# Altium schematic sheet 11 USB_2.SchDoc
size 420 x 297 mm; Address1: Address1; Address2: Address2; Address3: Address3; Address4: Address4; DocumentNumber: АБВГ.123456.001 Э3; SheetNumber: 11; SheetTotal: 23; Scale: 1:1; DocumentType: Схема электрическая принципиальная; FirstReferrence: АБВГ.123456.001
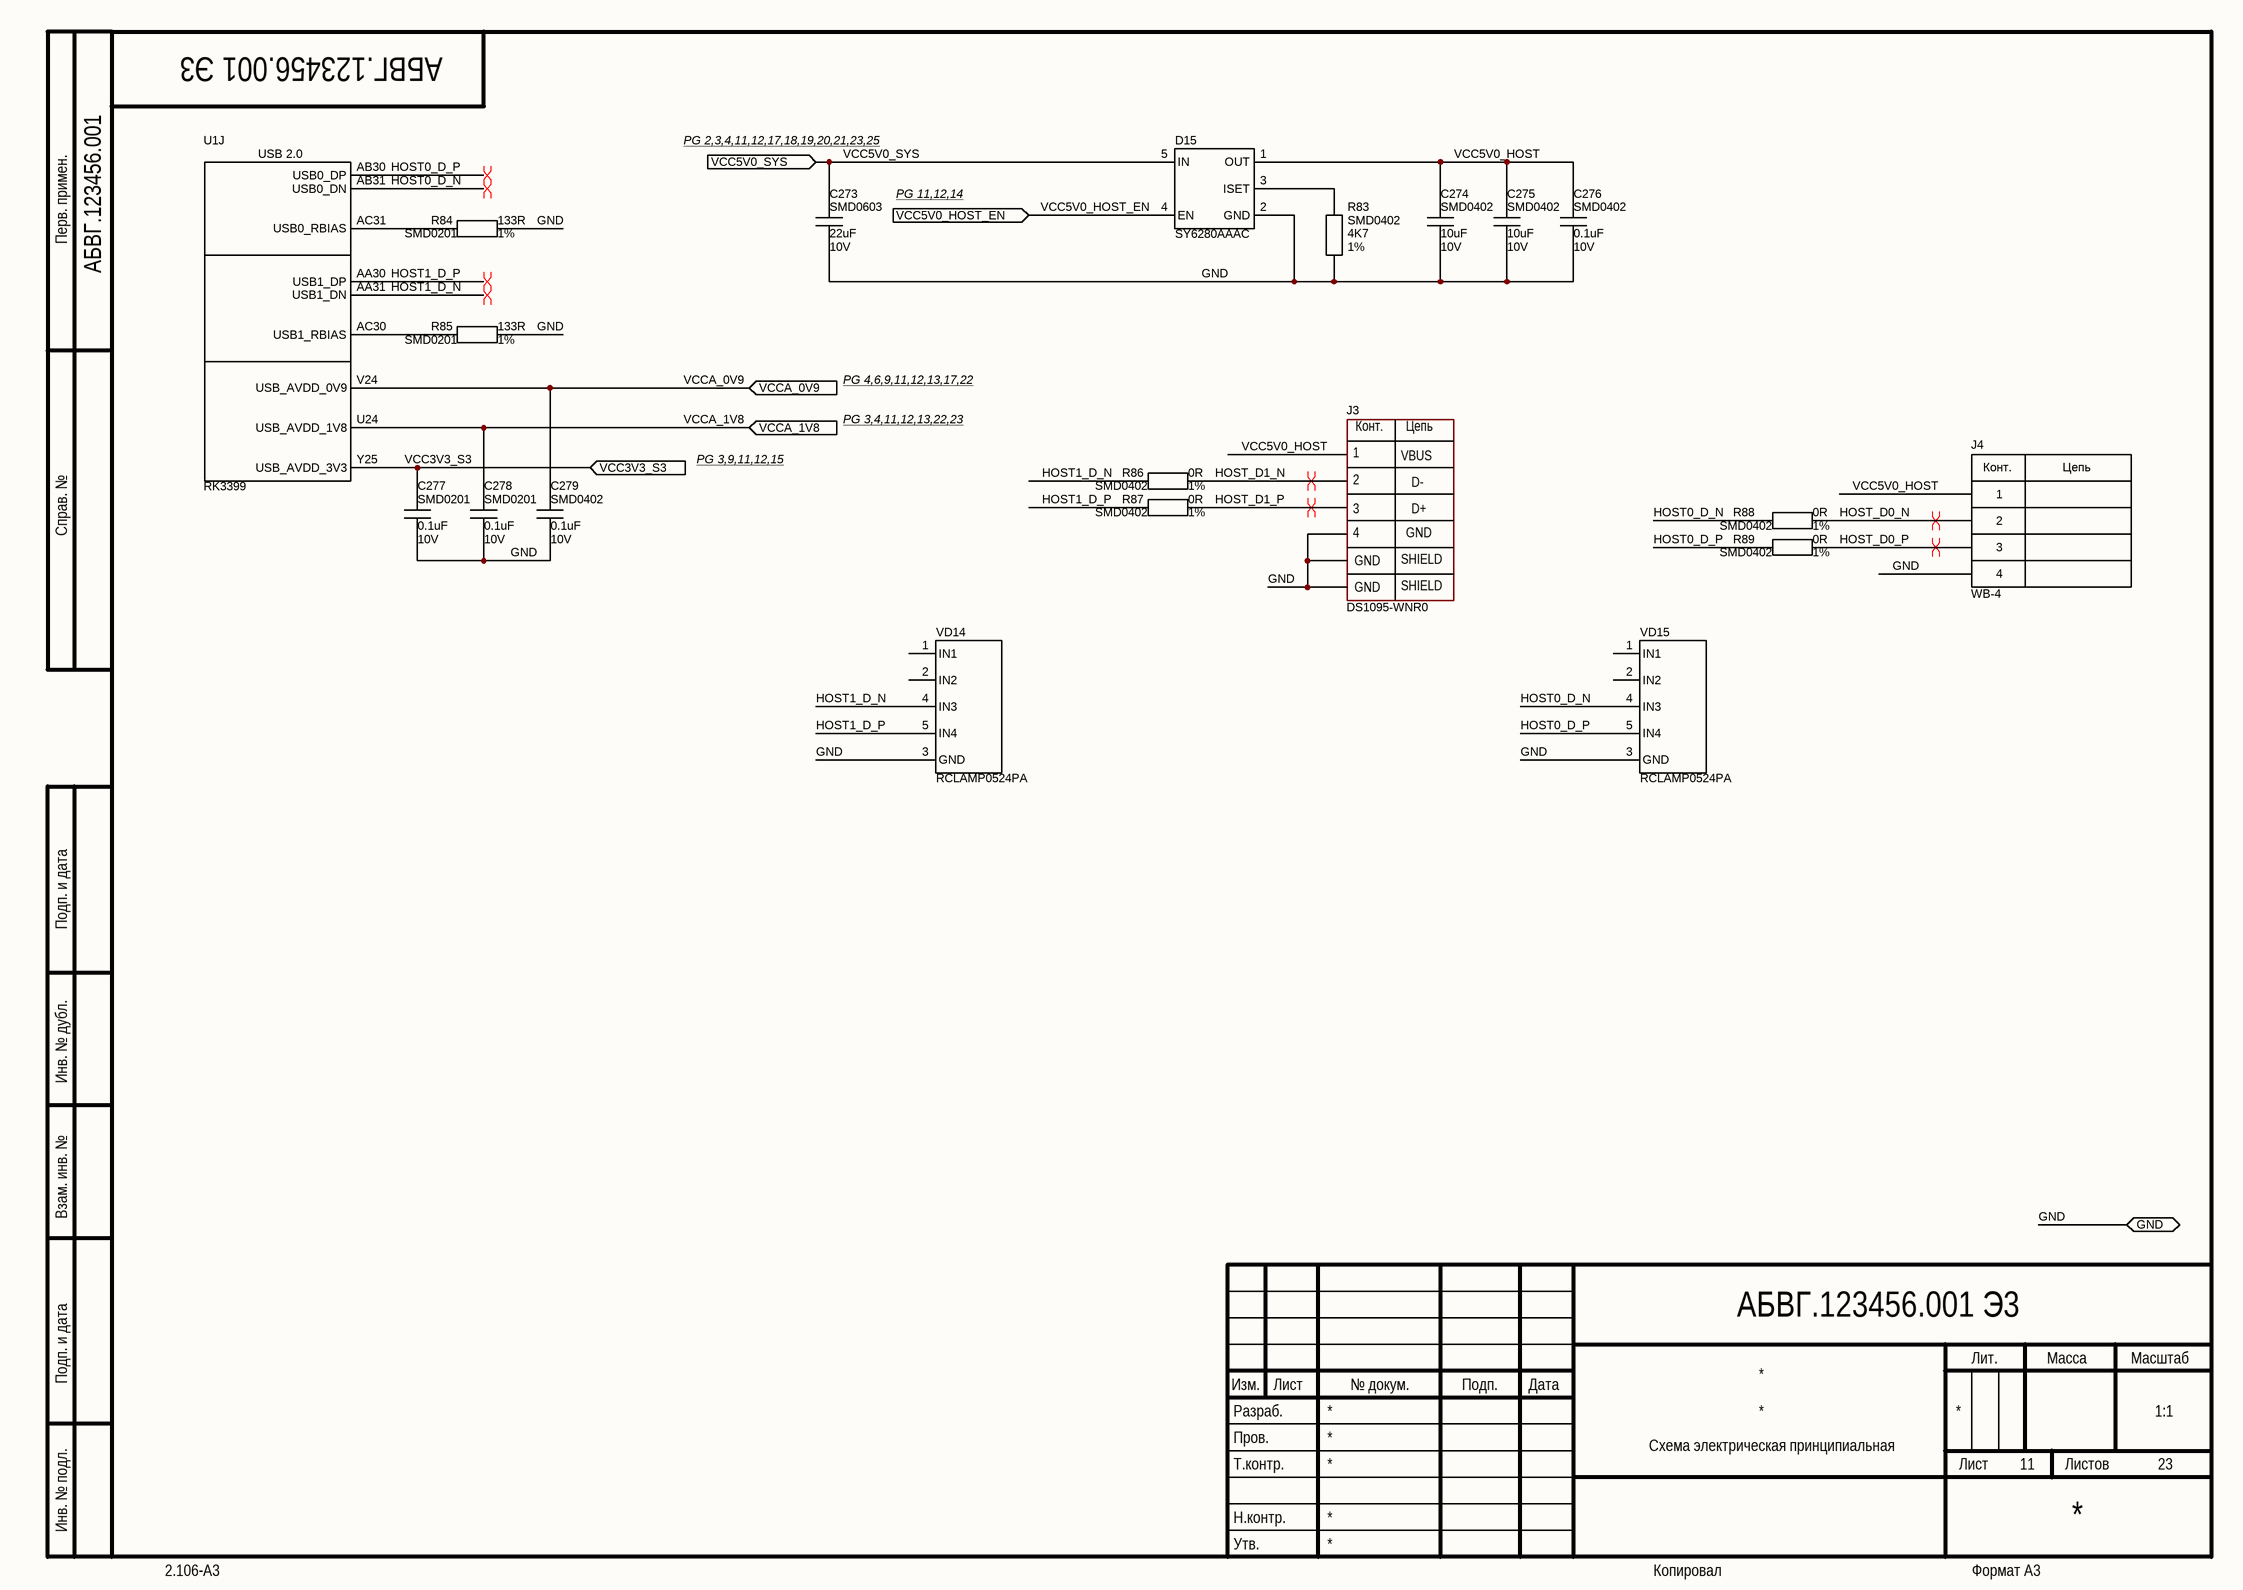
[diagram p0: 11 USB_2.SchDoc]

## Parts
C273  Package: SMD0603  Voltage: 10V  [CAP_SMD_0603]  (hidden comment: 22uF)
C274  Package: SMD0402  Voltage: 10V  [CAP_SMD_0402]  (hidden comment: 10uF)
C275  Package: SMD0402  Voltage: 10V  [CAP_SMD_0402]  (hidden comment: 10uF)
C276  Package: SMD0402  Voltage: 10V  [CAP_SMD_0402]  (hidden comment: 0.1uF)
C277  Package: SMD0201  Voltage: 10V  [CAP_SMD_0201]  (hidden comment: 0.1uF)
C278  Package: SMD0201  Voltage: 10V  [CAP_SMD_0201]  (hidden comment: 0.1uF)
C279  Package: SMD0402  Voltage: 10V  [CAP_SMD_0402]  (hidden comment: 0.1uF)
D15  SY6280AAAC  [SOT23-5]
J3  DS1095-WNR0  [DS1095-WNR0]
J4  WB-4  [WB-4]
R83  Package: SMD0402  Tolerance: 1%  [RES_SMD_0402]  (hidden comment: 4K7)
R84  Package: SMD0201  Tolerance: 1%  [RES_SMD_0201]  (hidden comment: 133R)
R85  Package: SMD0201  Tolerance: 1%  [RES_SMD_0201]  (hidden comment: 133R)
R86  Package: SMD0402  Tolerance: 1%  [RES_SMD_0402]  (hidden comment: 0R)
R87  Package: SMD0402  Tolerance: 1%  [RES_SMD_0402]  (hidden comment: 0R)
R88  Package: SMD0402  Tolerance: 1%  [RES_SMD_0402]  (hidden comment: 0R)
R89  Package: SMD0402  Tolerance: 1%  [RES_SMD_0402]  (hidden comment: 0R)
U1  value RK3399  [BGA828C65P31X31_2100X2100X161N]  (hidden comment: RK3399_FF)  (part J of 23)
VD14  RCLAMP0524PA  [RCLAMP0524PA]
VD15  RCLAMP0524PA  [RCLAMP0524PA]

## Ports
GND (bidir), VCC3V3_S3 (in), VCC5V0_HOST_EN (in), VCC5V0_SYS (in), VCCA_0V9 (in), VCCA_1V8 (in)

## Nets
GND: C273.1 C274.2 C275.2 C276.2 C277.2 C278.2 C279.2 D15.2(GND) J3.4 J3.S1(GND) J3.S2(GND) J4.4 R83.2 R84.1 R85.1 VD14.3(GND) VD15.3(GND) ; port GND
HOST0_D_N: R88.1 U1.AB31(USB0_DN) VD15.4(IN3)
HOST0_D_P: R89.1 U1.AB30(USB0_DP) VD15.5(IN4)
HOST1_D_N: R86.1 U1.AA31(USB1_DN) VD14.4(IN3)
HOST1_D_P: R87.1 U1.AA30(USB1_DP) VD14.5(IN4)
HOST_D0_N: J4.2 R88.2
HOST_D0_P: J4.3 R89.2
HOST_D1_N: J3.2 R86.2
HOST_D1_P: J3.3 R87.2
VCC3V3_S3: C277.1 U1.Y25(USB_AVDD_3V3) ; port VCC3V3_S3
VCC5V0_HOST: C274.1 C275.1 C276.1 D15.1(OUT) J3.1 J4.1
VCC5V0_HOST_EN: D15.4(EN) ; port VCC5V0_HOST_EN
VCC5V0_SYS: C273.2 D15.5(IN) ; port VCC5V0_SYS
VCCA_0V9: C279.1 U1.V24(USB_AVDD_0V9) ; port VCCA_0V9
VCCA_1V8: C278.1 U1.U24(USB_AVDD_1V8) ; port VCCA_1V8
NetD15_3: D15.3(ISET) R83.1
NetR84_2: R84.2 U1.AC31(USB0_RBIAS)
NetR85_2: R85.2 U1.AC30(USB1_RBIAS)

Not connected (* = marked no-connect by the designer): VD14 1(IN1) 2(IN2); VD15 1(IN1) 2(IN2)

## Layout directives
differential pair; differential pair class DiffPair_90_Ohms; net class DiffPair_90_Ohms: HOST0_D_P
differential pair; net class DiffPair_90_Ohms; net class DiffPair_90_Ohms; differential pair class DiffPair_90_Ohms; net class DiffPair_90_Ohms: HOST0_D_N, HOST1_D_N, HOST1_D_P, HOST_D1_N, HOST_D1_P
differential pair: HOST_D0_N, HOST_D0_P

## Notes on the sheet
- PG 2,3,4,11,12,17,18,19,20,21,23,25
- Перв. примен.
- PG 11,12,14
- PG 4,6,9,11,12,13,17,22
- PG 3,9,11,12,15
- PG 3,4,11,12,13,22,23
- Справ. №
- Подп. и дата
- Инв. № дубл.
- Взам. инв. №
- Разраб.
- Изм.
- Лист
- № докум.
- Подп.
- Дата
- Лит.
- Масса
- Масштаб
- Пров.
- Т.контр.
- Листов
- Инв. № подл.
- Утв.
- Н.контр.
- 2.106-A3
- Копировал
- Формат А3
- (in symbol CON4) Конт.; Цепь
- (in symbol RK3399_FF, part J) USB 2.0
- (in symbol USBA-1J) Конт.; Цепь; VBUS; D-; D+; SHIELD

## Library data of the parts
C273 = Ceramic_Cap: PartNumber: CL10A226MP8NUNE; ComponentType: SMD Ceramic Chip Capacitor; Manufacter: *; Tolerance: *; ClassName: *; Value: 22uF
C274 C275 = Ceramic_Cap: PartNumber: CC0402MRX5R6BB106; ComponentType: SMD Ceramic Chip Capacitor; Manufacter: *; Tolerance: *; ClassName: *; Value: 10uF
C276 C279 = Ceramic_Cap: PartNumber: CC0402KRX5R6BB104; ComponentType: SMD Ceramic Chip Capacitor; Manufacter: *; Tolerance: *; ClassName: *; Value: 0.1uF
C277 C278 = Ceramic_Cap: PartNumber: CC0201KRX5R6BB104; ComponentType: SMD Ceramic Chip Capacitor; Manufacter: *; Tolerance: *; ClassName: *; Value: 0.1uF
J3 = USBA-1J: ComponentType: *; Manufacter: *; Package: DS1095-WNR0; PartNumber: DS1095-WNR0; Value: DS1095-WNR0
J4 = CON4: PartNumber: DS1066-04M(MW-4M); Manufacter: *; Package: WB-4; ClassName: *; Value: WB-4
R83 = Chip_Res: PartNumber: RC0402FR-074K7L; ComponentType: SMD Chip Resistor; Manufacter: *; Voltage: *; ClassName: *; Value: 4K7
R84 R85 = Chip_Res: PartNumber: RC0201FR-07133RL; ComponentType: SMD Chip Resistor; Manufacter: *; Voltage: *; ClassName: *; Value: 133R
R86-R89 = Chip_Res: PartNumber: RC0402FR-070RL; ComponentType: SMD Chip Resistor; Manufacter: *; Voltage: *; ClassName: *; Value: 0R
D15 = SY6280AAAC: ComponentType: SMD Chip Resistor; Manufacter: *; Voltage: *; ClassName: *; Tolerance: *; PartNumber: SY6280AAAC; Package: SOT23-5; Value: SY6280AAAC
U1 = RK3399_FF: Package: BGA828; ComponentType: *; Manufacter: *; PartNumber: RK3399; ClassName: *
VD14 VD15 = RCLAMP0524PA: ComponentType: *; Manufacter: *; Package: RCLAMP0524PA; PartNumber: RCLAMP0524PA; ClassName: *; Value: RCLAMP0524PA